# EAGLE design PIC32_Pinguino_Rev_B (EAGLE 4.16)
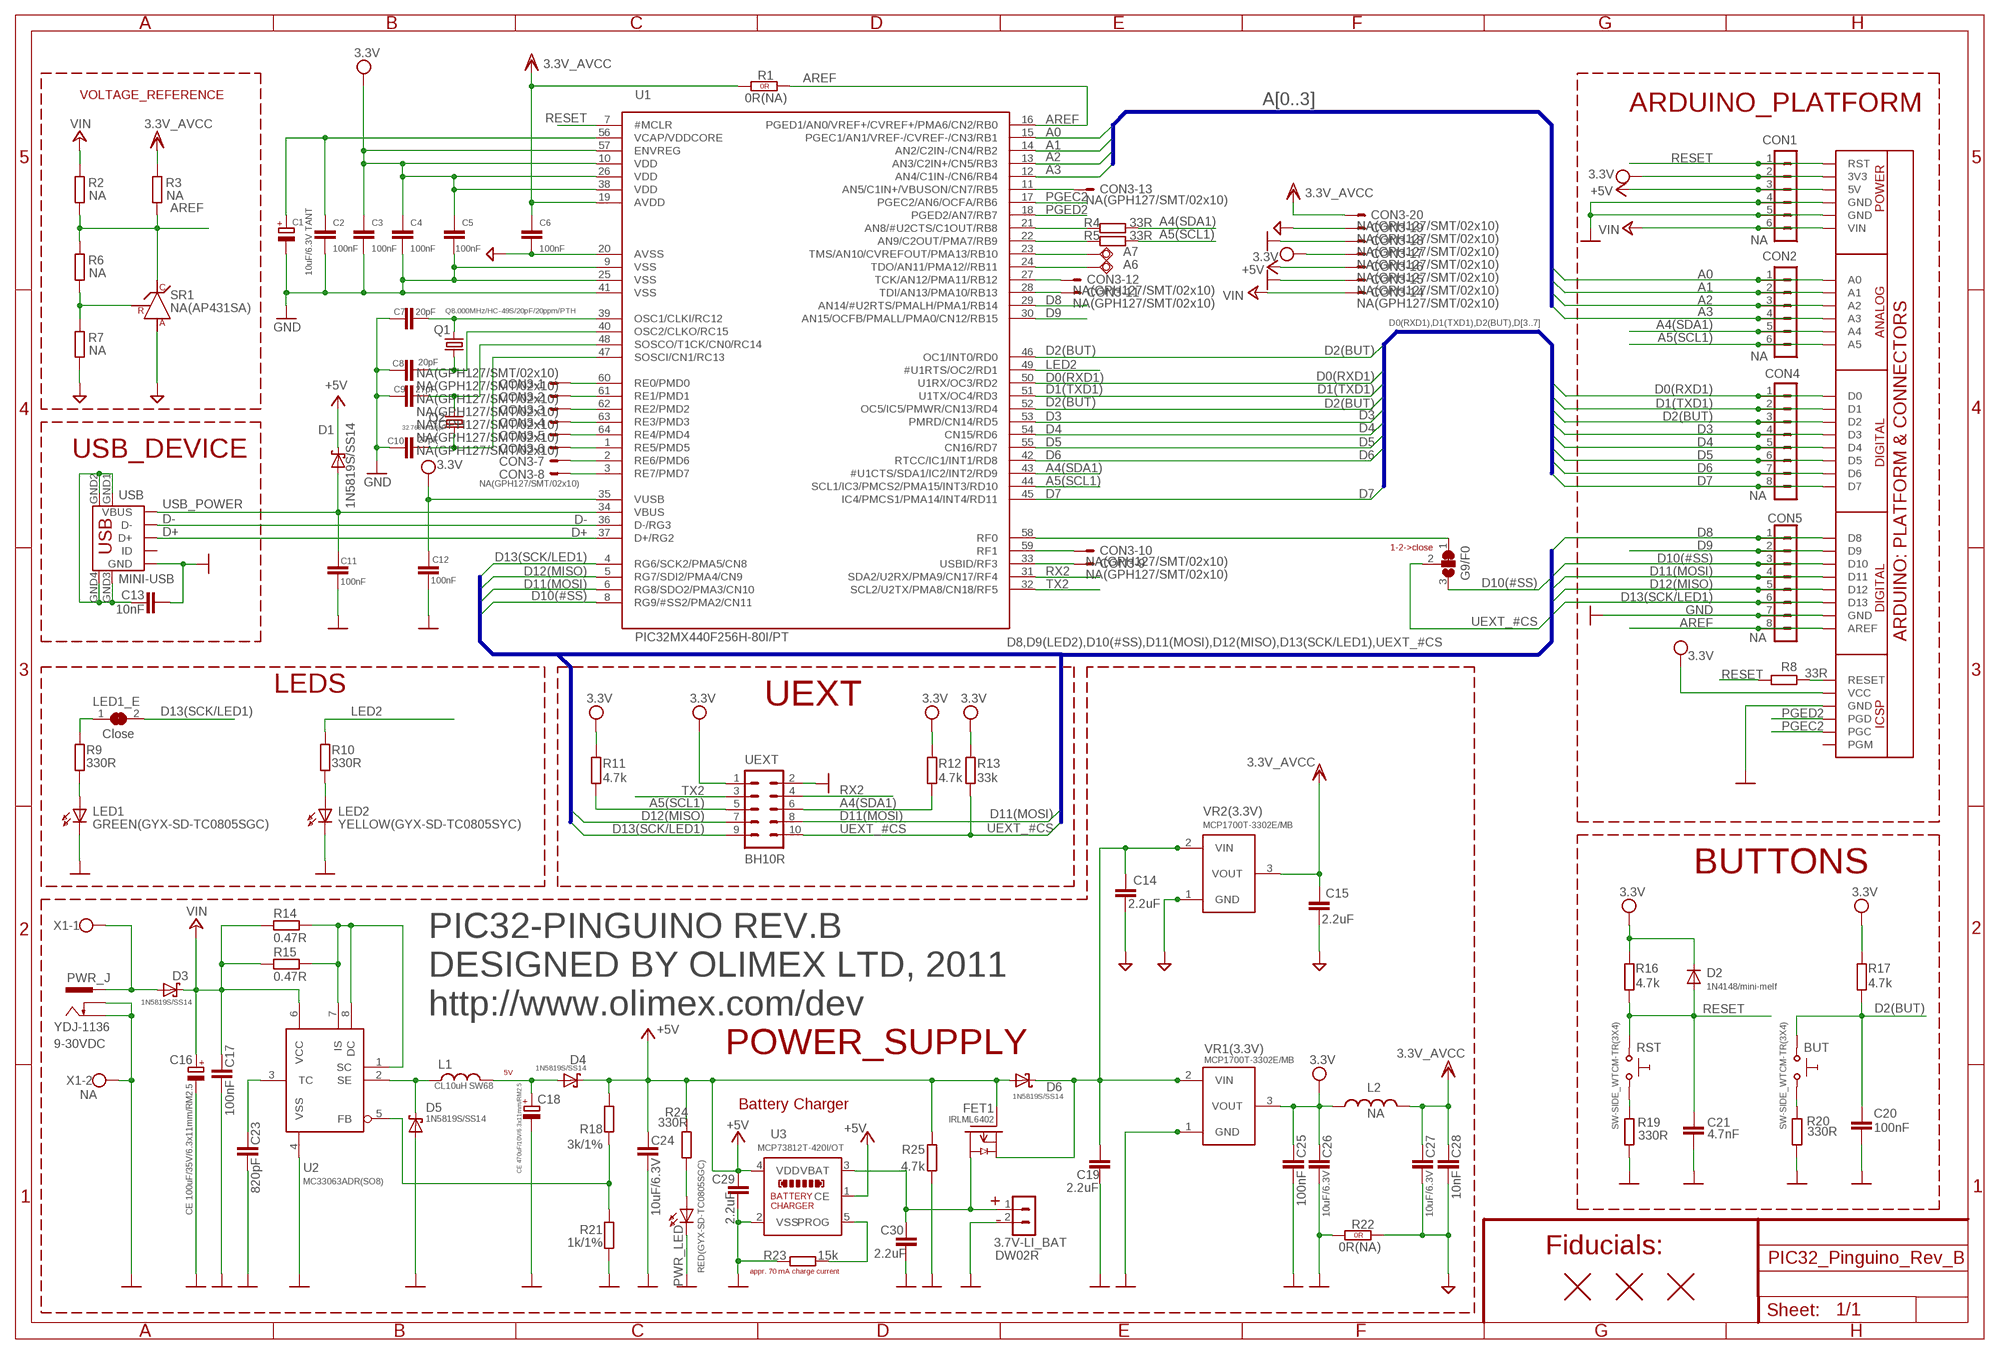
[diagram p0: schematic, sheet 1]

## Parts
3.7V-LI_BAT  DW02R  CON2DW02R  [DW02R]
A6  TESTPAD40/70  [TESTPAD]
A7  TESTPAD40/70  [TESTPAD]
BUT  SW-SIDE_WTCM-TR(3X4)  SW-TAKTSIDE_WTCM-TR(3X4)  [SW_TAKT3X4]
C1  10uF/6.3V TANT  CPOL-EUCT3216  [CT3216]
C2  100nF  C-EUC0603_DWS  [C0603_DWS]
C3  100nF  C-EUC0603_DWS  [C0603_DWS]
C4  100nF  C-EUC0603_DWS  [C0603_DWS]
C5  100nF  C-EUC0603_DWS  [C0603_DWS]
C6  100nF  C-EUC0603_DWS  [C0603_DWS]
C7  20pF  C-EUC0603_DWS  [C0603_DWS]
C8  20pF  C-EUC0603_DWS  [C0603_DWS]
C9  27pF  C-EUC0603_DWS  [C0603_DWS]
C10  27pF  C-EUC0603_DWS  [C0603_DWS]
C11  100nF  C-EUC0603_DWS  [C0603_DWS]
C12  100nF  C-EUC0603_DWS  [C0603_DWS]
C13  10nF  C-EUC0603_DWS  [C0603_DWS]
C14  2.2uF  C-EUC0603_DWS  [C0603_DWS]
C15  2.2uF  C-EUC0603_DWS  [C0603_DWS]
C16  CE 100uF/35V/6.3x11mm/RM2.5  CPOL-EUE2.5-6.3  [E2,5-6,3]
C17  100nF  C-EUC0603_DWS  [C0603_DWS]
C18  CE 470uF/10V/6.3x11mm/RM2.5  CPOL-EUE2.5-6.3  [E2,5-6,3]
C19  2.2uF  C-EUC0603_DWS  [C0603_DWS]
C20  100nF  C-EUC0603_DWS  [C0603_DWS]
C21  4.7nF  C-EUC0603_DWS  [C0603_DWS]
C23  820pF  C-EUC0603_DWS  [C0603_DWS]
C24  10uF/6.3V  C-EUC0805_5MIL_DWS  [C0805_5MIL_DWS]
C25  100nF  C-EUC0603_DWS  [C0603_DWS]
C26  10uF/6.3V  C-EUC0805_5MIL_DWS  [C0805_5MIL_DWS]
C27  10uF/6.3V  C-EUC0805_5MIL_DWS  [C0805_5MIL_DWS]
C28  10nF  C-EUC0603_DWS  [C0603_DWS]
C29  2.2uF  C-EUC0603_DWS  [C0603_DWS]
C30  2.2uF  C-EUC0603_DWS  [C0603_DWS]
CON1  NA  CON6PN1X6  [PN1X6]
CON2  NA  CON6PN1X6  [PN1X6]
CON3  NA(GPH127/SMT/02x10)  ML2050MILSE  [ML20_50MILS_M]
CON4  NA  CON8PN1X8  [PN1X8]
CON5  NA  CON8PN1X8  [PN1X8]
D1  1N5819S/SS14  SCHOTKKY7.62SS2  [MLL-41]
D2  1N4148/mini-melf  DSMD  [MINI-MELF]
D3  1N5819S/SS14  SCHOTKKY7.62SS2  [MLL-41]
D4  1N5819S/SS14  SCHOTKKY7.62SS2  [MLL-41]
D5  1N5819S/SS14  SCHOTKKY7.62SS2  [MLL-41]
D6  1N5819S/SS14  SCHOTKKY7.62SS2  [MLL-41]
FET1  IRLML6402  [SOT23]
G9/F0  SJ2W3  [SJ_2_SMALL]
L1  CL10uH SW68  LSW68  [SW68]
L2  NA  L-USL3216C  [L3216C]
LED1  GREEN(GYX-SD-TC0805SGC)  LED0805DWS  [LED-0805]
LED1_E  Close  SJSJ-CLOSE  [SJ-CLOSE]
LED2  YELLOW(GYX-SD-TC0805SYC)  LED0805DWS  [LED-0805]
PWR_J  YDJ-1136  PWR-JAKPWR_JACK_UNI_MILLING  [PWR_JACK_UNI_MILLING]
PWR_LED  RED(GYX-SD-TC0805SGC)  LED0805DWS  [LED-0805]
Q1  Q8.000MHz/HC-49S/20pF/20ppm/PTH  HC49/S1  [HC49/SMD2_THIN]
Q2  32.768 kHz/6pF  TC26HTC26H_3_REPAIR  [TC26H_3_REPAIR]
R1  0R(NA)  R_0R0R(NA)  [0603_0R]
R2  NA  R-EU_R0603_5MIL_DWS  [R0603_5MIL_DWS]
R3  NA  R-EU_R0603_5MIL_DWS  [R0603_5MIL_DWS]
R4  33R  R-EU_R0603_5MIL_DWS  [R0603_5MIL_DWS]
R5  33R  R-EU_R0603_5MIL_DWS  [R0603_5MIL_DWS]
R6  NA  R-EU_R0603_5MIL_DWS  [R0603_5MIL_DWS]
R7  NA  R-EU_R0603_5MIL_DWS  [R0603_5MIL_DWS]
R8  33R  R-EU_R0603_5MIL_DWS  [R0603_5MIL_DWS]
R9  330R  R-EU_R0603_5MIL_DWS  [R0603_5MIL_DWS]
R10  330R  R-EU_R0603_5MIL_DWS  [R0603_5MIL_DWS]
R11  4.7k  R-EU_R0603_5MIL_DWS  [R0603_5MIL_DWS]
R12  4.7k  R-EU_R0603_5MIL_DWS  [R0603_5MIL_DWS]
R13  33k  R-EU_R0603_5MIL_DWS  [R0603_5MIL_DWS]
R14  0.47R  R-EU_R1206_5MIL_WS  [R1206_5MIL_WS]
R15  0.47R  R-EU_R1206_5MIL_WS  [R1206_5MIL_WS]
R16  4.7k  R-EU_R0603_5MIL_DWS  [R0603_5MIL_DWS]
R17  4.7k  R-EU_R0603_5MIL_DWS  [R0603_5MIL_DWS]
R18  3k/1%  R-EU_R0603_5MIL_DWS  [R0603_5MIL_DWS]
R19  330R  R-EU_R0603_5MIL_DWS  [R0603_5MIL_DWS]
R20  330R  R-EU_R0603_5MIL_DWS  [R0603_5MIL_DWS]
R21  1k/1%  R-EU_R0603_5MIL_DWS  [R0603_5MIL_DWS]
R22  0R(NA)  R_0R0R(NA)  [0603_0R]
R23  15k  R-EU_R0603_5MIL_DWS  [R0603_5MIL_DWS]
R24  330R  R-EU_R0603_5MIL_DWS  [R0603_5MIL_DWS]
R25  4.7k  R-EU_R0603_5MIL_DWS  [R0603_5MIL_DWS]
RST  SW-SIDE_WTCM-TR(3X4)  SW-TAKTSIDE_WTCM-TR(3X4)  [SW_TAKT3X4]
SR1  NA(AP431SA)  TL431'''  [SOT-23]
U1  PIC32MX440F256H-80I/PT  PIC32MX440F256H"  [LPTQFP64]
U2  MC33063ADR(SO8)  MC34063A2  [SO-8]
U3  MCP73812T-420I/OT  MCP7381XSOT-23-5  [SOT-23-5]
U$1  3xPN1x8+1xPN1x6+WU06S  PIC_PLATFORM  [PIC_PLATFORM]
U$2  FIDUCIAL1X2  [FIDUCIAL-1X2]
U$3  FIDUCIAL1X2  [FIDUCIAL-1X2]
U$4  FIDUCIAL1X2  [FIDUCIAL-1X2]
UEXT  BH10R  ML10L  [ML10L]
USB  MINI-USB  MINI_USB9  [USB_MINI_9PIN]
VR1(3.3V)  MCP1700T-3302E/MB  MCP1700-REP1  [SOT89_REP_THERMALOFF]
VR2(3.3V)  MCP1700T-3302E/MB  MCP1700-REP1  [SOT89_REP_THERMALOFF]
X1  NA  W237-102  [W237-102]

## Nets
+5V: C24.1 C29.1 CON1.3 CON3.16 D1.K(C) D4.K(C) D6.A FET1.1(G) R18.1 R24.1 R25.1 U3.1(CE) U3.4(VDD) U$1.5V
+24V: C16.+ C17.1 CON1.6 CON3.14 D3.K(C) R2.2 R14.1 R15.1 U2.6(VCC) U$1.VIN ; supply symbol labelled VIN
A0: CON2.1 U1.15(PGEC1/AN1/VREF-/CVREF-/CN3/RB1) U$1.A0
A1: CON2.2 U1.14(AN2/C2IN-/CN4/RB2) U$1.A1
A2: CON2.3 U1.13(AN3/C2IN+/CN5/RB3) U$1.A2
A3: CON2.4 U1.12(AN4/C1IN-/CN6/RB4) U$1.A3
A4(SDA1): CON2.5 R4.1 R12.1 U1.43(#U1CTS/SDA1/IC2/INT2/RD9) U$1.A4 UEXT.6
A5(SCL1): CON2.6 R5.1 R11.1 U1.44(SCL1/IC3/PMCS2/PMA15/INT3/RD10) U$1.A5 UEXT.5
AGND: C6.2 C14.2 C15.2 C27.2 C28.2 CON3.19 R7.1 R22.2(1.2) SR1.3(A) U1.20(AVSS) VR2(3.3V).1(GND)
AREF: CON5.8 R1.2(1.2) R2.1 R3.1 R6.2 SR1.1(C) U1.16(PGED1/AN0/VREF+/CVREF+/PMA6/CN2/RB0) U$1.AREF
D0(RXD1): CON4.1 U1.50(U1RX/OC3/RD2) U$1.D0
D1(TXD1): CON4.2 U1.51(U1TX/OC4/RD3) U$1.D1
D2(BUT): BUT.2_1 C20.1 CON4.3 R17.2 U1.46(OC1/INT0/RD0) U1.52(OC5/IC5/PMWR/CN13/RD4) U$1.D2
D3: CON4.4 U1.53(PMRD/CN14/RD5) U$1.D3
D4: CON4.5 U1.54(CN15/RD6) U$1.D4
D5: CON4.6 U1.55(CN16/RD7) U$1.D5
D6: CON4.7 U1.42(RTCC/IC1/INT1/RD8) U$1.D6
D7: CON4.8 U1.45(IC4/PMCS1/PMA14/INT4/RD11) U$1.D7
D8: CON5.1 U1.29(AN14/#U2RTS/PMALH/PMA1/RB14) U$1.D8
D9: CON5.2 U1.30(AN15/OCFB/PMALL/PMA0/CN12/RB15) U$1.D9
D10(#SS): CON5.3 G9/F0.3 U1.8(RG9/#SS2/PMA2/CN11) U$1.D10
D11(MOSI): CON5.4 U1.6(RG8/SDO2/PMA3/CN10) U$1.D11 UEXT.8
D12(MISO): CON5.5 U1.5(RG7/SDI2/PMA4/CN9) U$1.D12 UEXT.7
D13(SCK/LED1): CON5.6 LED1_E.2 U1.4(RG6/SCK2/PMA5/CN8) U$1.D13 UEXT.9
D+: U1.37(D+/RG2) USB.D+
D-: U1.36(D-/RG3) USB.D-
GND [pwr]: 3.7V-LI_BAT.2 C1.- C2.2 C3.2 C4.2 C5.2 C7.1 C8.1 C9.1 C10.1 C11.1 C12.1 C13.2 C16.- C17.2 C18.- C19.2 C20.2 C21.2 C23.2 C24.2 C25.2 C26.2 C29.2 C30.2 CON1.4 CON1.5 CON3.15 CON3.18 CON5.7 D5.A LED1.C LED2.C PWR_J.- PWR_J.-- PWR_LED.C R19.1 R20.1 R21.2 R22.1(1.1) R23.1 R25.2 U1.9(VSS) U1.25(VSS) U1.41(VSS) U2.4(VSS) U3.2(VSS) U$1.GND U$1.GND@1(GND) U$1.GND@2(GND) U$1.GND@3(GND) UEXT.2 USB.GND VR1(3.3V).1(GND) X1.2
LED2: R10.2 U1.49(#U1RTS/OC2/RD1)
N$1: CON3.13 U1.11(AN5/C1IN+/VBUSON/CN7/RB5)
N$2: LED1_E.1 R9.2
N$3: R4.2 U1.21(AN8/#U2CTS/C1OUT/RB8)
N$4: R8.1 U$1.RESET
N$5: LED2.A R10.1
N$6: R5.2 U1.22(AN9/C2OUT/PMA7/RB9)
N$7: C18.+ D4.A L1.2
N$8: PWR_LED.A R24.2
N$9: A6.P$1(PP) U1.24(TDO/AN11/PMA12//RB11)
N$10: A7.P$1(PP) U1.23(TMS/AN10/CVREFOUT/PMA13/RB10)
N$11 [pwr]: R19.2 RST.1_1
N$12 [pwr]: BUT.1_1 R20.2
N$13: D3.A PWR_J.+ X1.1
N$14: CON3.12 U1.27(TCK/AN12/PMA11/RB12)
N$15: CON3.11 U1.28(TDI/AN13/PMA10/RB13)
N$16: C1.+ C2.1 U1.56(VCAP/VDDCORE)
N$17: C7.2 Q1.2 U1.39(OSC1/CLKI/RC12)
N$18: CON3.10 U1.59(RF1)
N$19: C8.2 Q1.1 U1.40(OSC2/CLKO/RC15)
N$20: C10.2 Q2.2 U1.47(SOSCI/CN1/RC13)
N$21: C9.2 Q2.1 U1.48(SOSCO/T1CK/CN0/RC14)
N$22: R23.2 U3.5(PROG)
N$23: LED1.A R9.1
N$24: CON3.9 U1.33(USBID/RF3)
N$25: CON3.1 U1.60(RE0/PMD0)
N$26: CON3.2 U1.61(RE1/PMD1)
N$27: CON3.3 U1.62(RE2/PMD2)
N$28: CON3.4 U1.63(RE3/PMD3)
N$29: CON3.5 U1.64(RE4/PMD4)
N$30: CON3.6 U1.1(RE5/PMD5)
N$31: CON3.7 U1.2(RE6/PMD6)
N$32: CON3.8 U1.3(RE7/PMD7)
N$33: C23.1 U2.3(TC)
N$34: C14.1 C19.1 D6.K(C) FET1.2(S) VR1(3.3V).2(VIN) VR1(3.3V).P$2(VIN1) VR2(3.3V).2(VIN) VR2(3.3V).P$2(VIN1)
N$36: R6.1 R7.2 SR1.2(R)
N$38: G9/F0.1 U1.58(RF0)
N$61: R18.2 R21.1 U2.5(FB)
N$64: R14.2 R15.2 U2.1(SC) U2.7(IS) U2.8(DC)
N$67 [pwr]: D5.K(C) L1.1 U2.2(SE)
PGEC2: U1.17(PGEC2/AN6/OCFA/RB6) U$1.PGC
PGED2: U1.18(PGED2/AN7/RB7) U$1.PGD
RESET: C21.1 CON1.1 D2.A R8.2 R16.2 RST.2_1 U1.7(#MCLR) U$1.RST
RX2: U1.31(SDA2/U2RX/PMA9/CN17/RF4) UEXT.4
TX2: U1.32(SCL2/U2TX/PMA8/CN18/RF5) UEXT.3
UEXT_#CS: G9/F0.2 R13.1 UEXT.10
USB_POWER: C11.2 D1.A U1.34(VBUS) USB.VBUS
USB_SHIELD: C13.1 USB.GND1 USB.GND2 USB.GND3 USB.GND4
VBAT: 3.7V-LI_BAT.1 C30.1 FET1.3(D) U3.3(VBAT)
VCC: C3.1 C4.1 C5.1 C12.2 C25.1 C26.1 CON1.2 CON3.17 D2.C(K) L2.1 R11.2 R12.2 R13.2 R16.1 R17.1 U1.10(VDD) U1.26(VDD) U1.35(VUSB) U1.38(VDD) U1.57(ENVREG) U$1.3V3 U$1.VCC UEXT.1 VR1(3.3V).3(VOUT) ; supply symbol labelled 3.3V
VDD: C6.1 C15.1 C27.1 C28.1 CON3.20 L2.2 R1.1(1.1) R3.2 U1.19(AVDD) VR2(3.3V).3(VOUT) ; supply symbol labelled 3.3V_AVCC
Unconnected: U$1.PGM USB.ID

## Buses
A[0..3]
D0(RXD1),D1(TXD1),D2(BUT),D[3..7]
D8,D9(LED2),D10(#SS),D11(MOSI),D12(MISO),D13(SCK/LED1),UEXT_#CS

## Notes on the sheet
- VOLTAGE_REFERENCE
- ARDUINO_PLATFORM
- USB_DEVICE
- 1-2->close
- LEDS
- UEXT
- BUTTONS
- PIC32-PINGUINO REV.B
- DESIGNED BY OLIMEX LTD, 2011
- http://www.olimex.com/dev
- 9-30VDC
- POWER_SUPPLY
- 5V
- Battery Charger
- +
- -
- Fiducials:
- appr. 70 mA charge current

## Library data of the parts
3.7V-LI_BAT = Penko:CON2
A6 A7 = gogo:TESTPAD: drill 40mils, diameter 70mils
BUT RST = gogo:SW-TAKT
C1 C16 C18 = rcl:CPOL-EU: POLARIZED CAPACITOR, European symbol
C2-C15 C17 C19-C21 C23-C30 = rcl:C-EU: CAPACITOR, European symbol
CON1 CON2 = Penko:CON6: CONNECTORS - 6 PINS
CON3 = con-harting-ml:ML20?E: HARTING
CON4 CON5 = Penko:CON8
D1 D3-D6 = gogo:SCHOTKKY7.62SS
D2 = DOUBLE-SIDE:D: DIODES
FET1 = gogo:IRLML6402
G9/F0 = jumper:SJ2W: SMD solder JUMPER
L1 = DOUBLE-SIDE:L
L2 = rcl:L-US: INDUCTOR, American symbol
LED1 LED2 PWR_LED = DOUBLE-SIDE:LED
LED1_E = jumper:SJ: SMD solder JUMPER
PWR_J = gogo:PWR-JAK
Q1 = crystal:HC49/S: CRYSTAL
Q2 = crystal:TC26H: CRYSTAL
R1 R22 = OLIMEX_DISCRET:R_0R
R2-R21 R23-R25 = rcl:R-EU_: RESISTOR, European symbol
SR1 = OLIMEX_IC:TL431: TL431 Programmable Shunt Regulator Features: -> Programmable Output Voltage to 36 Volts -> Low Dynamic Output Impedance 0.20 Typical -> Sink Current Capability of 1.0 to 100mA -> Equivalent Full-Range Temperature Coefficient of 50ppm/°C Typical -> Temperature Compensated For Operation Over Full Rated Operating Temperature Range -> Low Output Noise Voltage -> Fast Turn-on Response
U1 = OLIMEX_IC:PIC32MX440F256H: USB Microcontroller MIPS32® M4K® 32-bit core with 5-stage pipeline 80 MHz maximum frequency 1.56 DMIPS/MHz (Dhrystone 2.1) performance at wait state Flash access Single-cycle multiply and high-performance divide unit MIPS16e® mode for up to 40% smaller code size Two sets of 32 core register files (32-bit) to reduce interrupt latency Prefetch Cache module to speed execution from Flash
U2 = MPLAB_ICD2:MC34063A
U3 = OLIMEX_DISCRET:MCP7381X
U$1 = OLIMEX_CASES:PIC_PLATFORM
U$2-U$4 = SparkFunEagle-6-6-07:FIDUCIAL: Fiducial Alignment Points Various fiducial points for machine vision alignment.
UEXT = con-harting-ml:ML10: HARTING
USB = OLIMEX_CONNECTORS:MINI_USB9
VR1(3.3V) VR2(3.3V) = OLIMEX_DISCRET:MCP1700-REP
X1 = con-wago-500:W237-102: WAGO SCREW CLAMP

## Net classes
1 pwr: width 0.4 mm, drill 0.23 mm

## Board
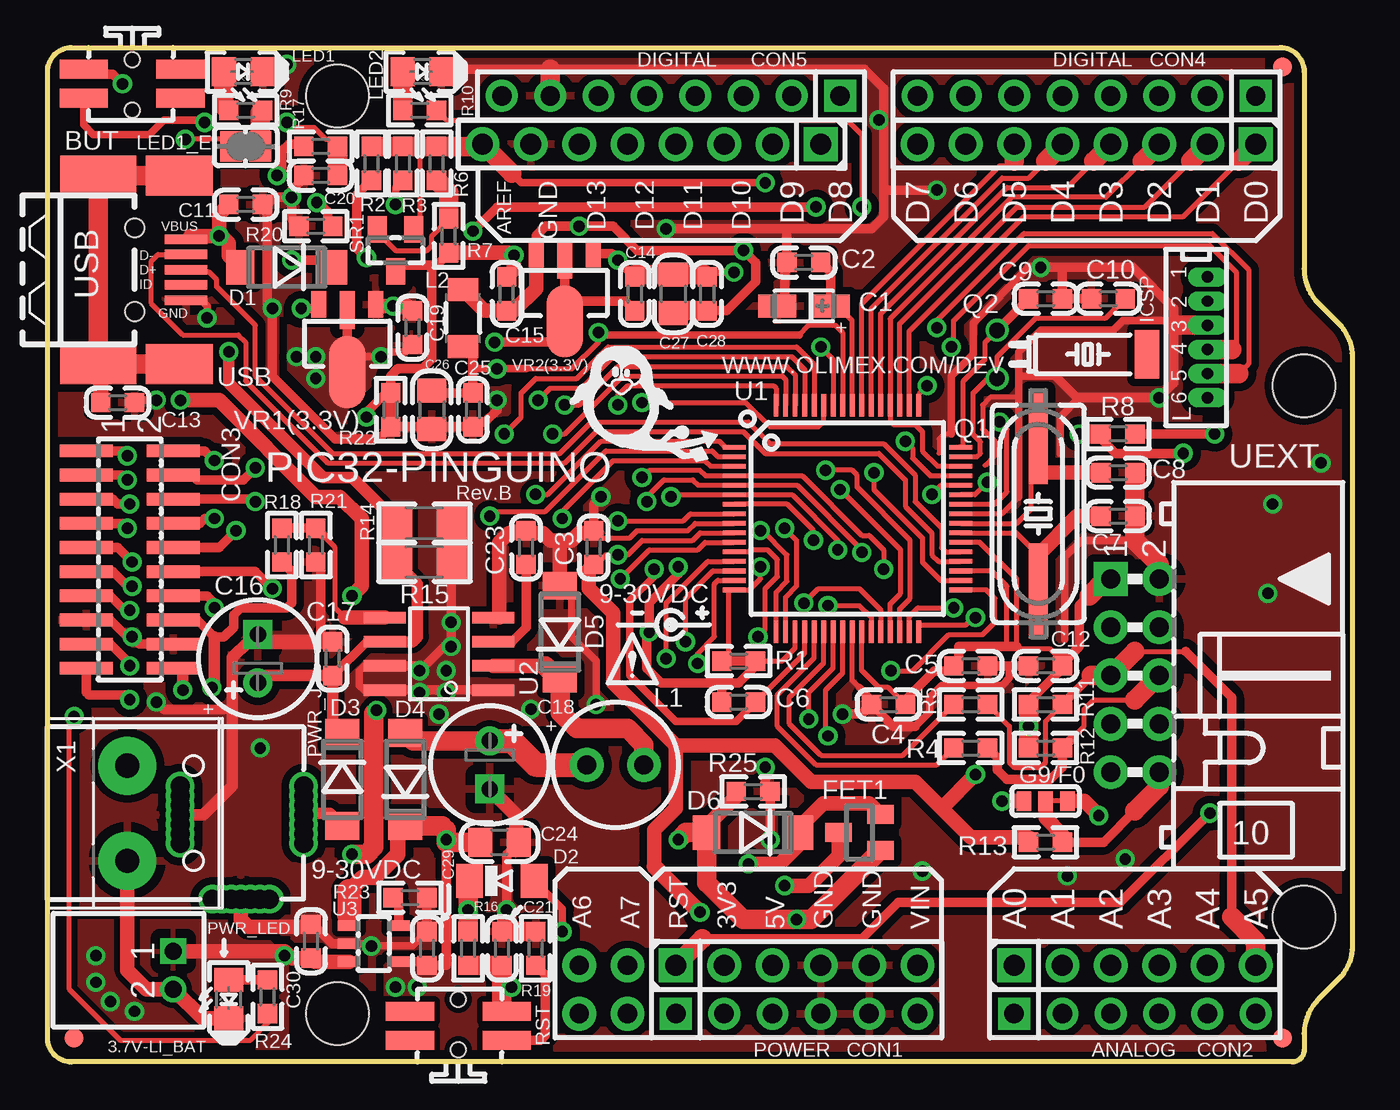
[diagram p1: board, top side]
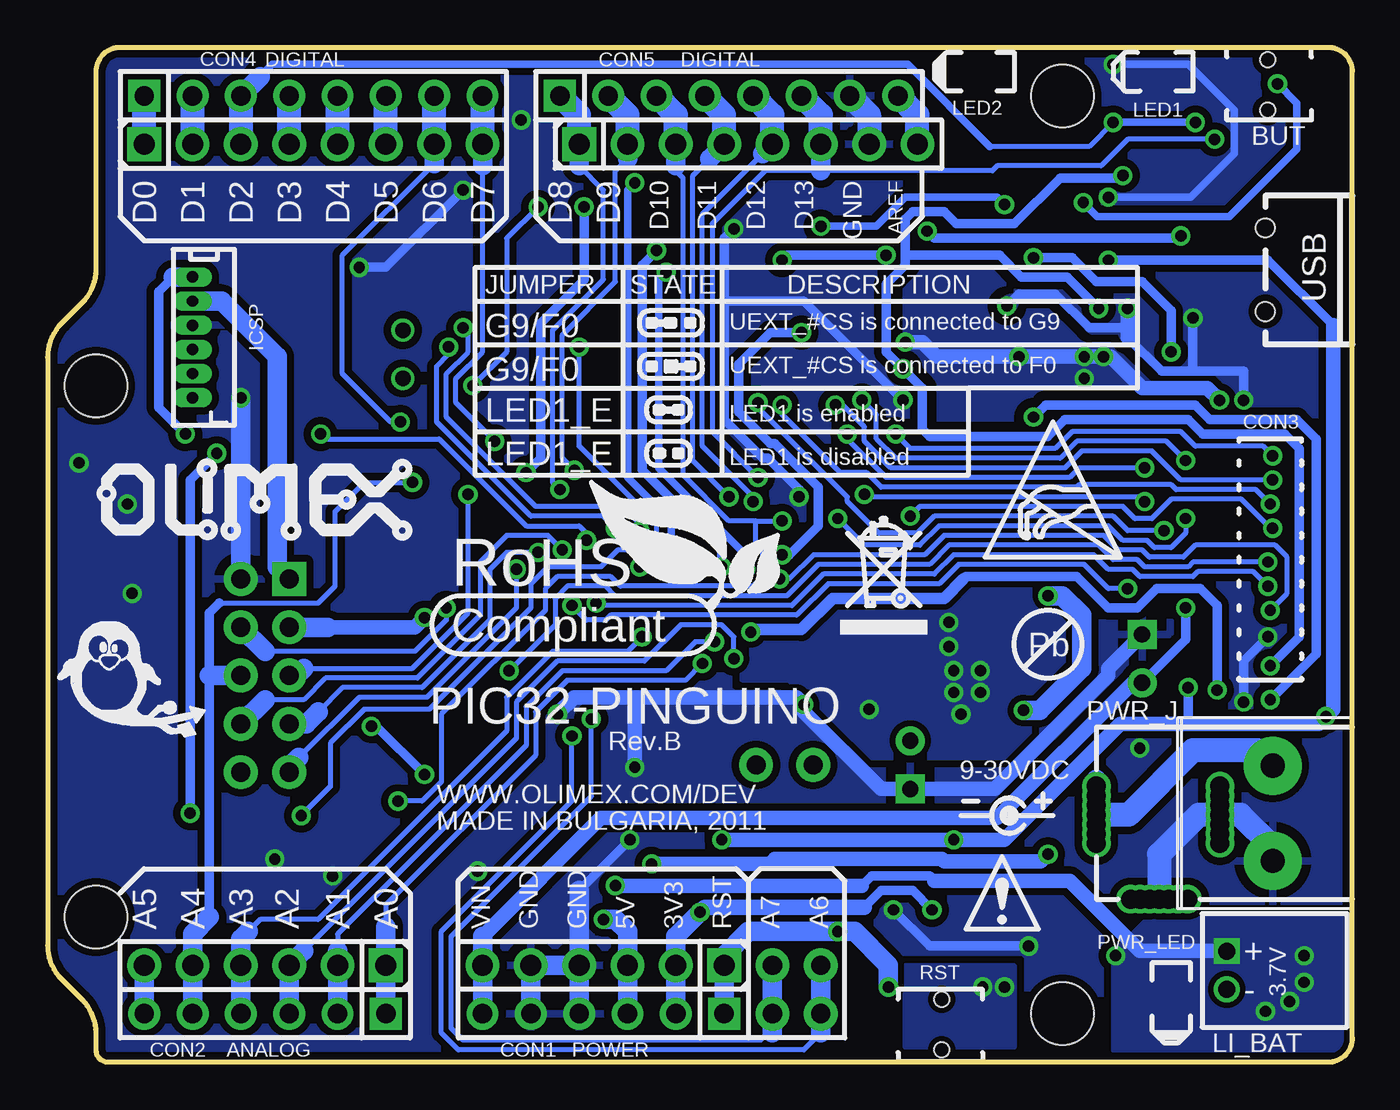
[diagram p2: board, bottom side, seen from below]

Size 68.58 x 53.34 mm. Coordinates in mm from the lower left corner, seen from the top.
Copper layers (1+16): Top 0.035mm / dielectric 1.5mm / Bottom 0.035mm
Design rules "default": minimum track width 10mil, minimum drill 0.6mm, track to track 9.5mil, track to pad 9.5mil, pad to pad 9.5mil, via to via 9.5mil, smd to smd 1mil, copper to edge 10mil, drill to drill 8mil, minimum pad ring 8mil, minimum via ring 8mil, stop-mask expansion 4mil, vias tented up to drill 25mil, thermal gap 20mil

### Footprints (pad centres in the part's own frame; a part is rotated, then mirrored left to right if it is on the bottom)
DW02R = drill 0.9 square: 1 -1,0 | drill 0.9 round: 2 1,0
TESTPAD = drill 1.016 pad 1.778 round: P$1 0,0
SW_TAKT3X4 = smd 2.54 x 1.016: 1_1 -2.54,0.762; 1_2 2.54,0.762; 2_1 -2.54,-0.762; 2_2 2.54,-0.762 | hole 0.8: 0,-1.397; 0,1.27
CT3216 = smd 2 x 1.2: + -1.4,0; - 1.4,0
C0603_DWS = smd 1.016 x 1.016: 1 -0.889,0; 2 0.889,0
E2,5-6,3 = drill 0.864 pad 1.524 round: + -1.27,0 | drill 0.864 pad 1.524 square: - 1.27,0
C0805_5MIL_DWS = smd 1.27 x 1.524: 1 -1.016,0; 2 1.016,0
PN1X6 = drill 1.1 pad 1.778 square: 1 -6.35,0 | drill 1.1 pad 1.778 round: 2 -3.81,0; 3 -1.27,0; 4 1.27,0; 5 3.81,0; 6 6.35,0
ML20_50MILS_M = smd 0.66 x 2.794: 1 -5.715,-2.286; 2 -5.715,2.286; 3 -4.445,-2.286; 4 -4.445,2.286; 5 -3.175,-2.286; 6 -3.175,2.286; 7 -1.905,-2.286; 8 -1.905,2.286; 9 -0.635,-2.286; 10 -0.635,2.286; 11 0.635,-2.286; 12 0.635,2.286; 13 1.905,-2.286; 14 1.905,2.286; 15 3.175,-2.286; 16 3.175,2.286; 17 4.445,-2.286; 18 4.445,2.286; 19 5.715,-2.286; 20 5.715,2.286
PN1X8 = drill 1.1 pad 1.778 square: 1 -8.89,0 | drill 1.1 pad 1.778 round: 2 -6.35,0; 3 -3.81,0; 4 -1.27,0; 5 1.27,0; 6 3.81,0; 7 6.35,0; 8 8.89,0
MLL-41 = smd 1.45 x 1.8: A 2.445,0; K -2.445,0
MINI-MELF = smd 1.4 x 1.8: A 1.7,0; C -1.7,0
SOT23 = smd 1 x 1.4: 1 -0.95,-1.1; 2 0.95,-1.1; 3 0,1.1
SJ_2_SMALL = smd 0.762 x 1.016: 1 -1.143,0; 2 0,0; 3 1.143,0
SW68 = drill 1 pad 1.778 round: 1 -1.5,0; 2 1.5,0
L3216C = smd 1.2 x 1.6: 1 -1.5,0; 2 1.5,0
LED-0805 = smd 1.27 x 1.524: A 1.016,0; C -1.016,0
SJ-CLOSE = smd 1.168 x 1.6: 1 -0.762,0; 2 0.762,0
PWR_JACK_UNI_MILLING = drill 1 round: + 0,4.75; +1 0,5.25; +2 0,5.75; +3 0,6.25; +4 0,4.25; +5 0,3.75; +6 0,3.25; - -6.5,4.75; -1 -6.5,5.25; -2 -6.5,5.75; -3 -6.5,4.25; -4 -6.5,3.75; -5 -6.5,6.25; -6 -6.5,3.25; -- -3.3,0.3; --1 -3.8,0.3; --2 -4.3,0.3; --3 -4.8,0.3; --4 -2.8,0.3; --5 -2.3,0.3; --6 -1.8,0.3
HC49/SMD2_THIN = smd 5 x 1: 1 -4.064,0; 2 4.064,0
TC26H_3_REPAIR = drill 0.813 round: 1 -1.27,0; 2 1.27,0 | smd 2.54 x 1.27: GND 0,7.874
0603_0R = smd 1.016 x 1.016: 1 -0.889,0; 2 0.889,0
R0603_5MIL_DWS = smd 1.016 x 1.016: 1 -0.889,0; 2 0.889,0
R1206_5MIL_WS = smd 1.651 x 1.778: 1 -1.46,0; 2 1.46,0
SOT-23 = smd 1 x 1.4: 1 -0.95,-1.1; 2 0.95,-1.1; 3 0,1.1
LPTQFP64 = smd 1.2 x 0.254: 1 -5.95,3.75; 2 -5.95,3.25; 3 -5.95,2.75; 4 -5.95,2.25; 5 -5.95,1.75; 6 -5.95,1.25; 7 -5.95,0.75; 8 -5.95,0.25; 9 -5.95,-0.25; 10 -5.95,-0.75; 11 -5.95,-1.25; 12 -5.95,-1.75; 13 -5.95,-2.25; 14 -5.95,-2.75; 15 -5.95,-3.25; 16 -5.95,-3.75; 33 5.95,-3.75; 34 5.95,-3.25; 35 5.95,-2.75; 36 5.95,-2.25; 37 5.95,-1.75; 38 5.95,-1.25; 39 5.95,-0.75; 40 5.95,-0.25; 41 5.95,0.25; 42 5.95,0.75; 43 5.95,1.25; 44 5.95,1.75; 45 5.95,2.25; 46 5.95,2.75; 47 5.95,3.25; 48 5.95,3.75 | smd 0.254 x 1.2: 17 -3.75,-5.95; 18 -3.25,-5.95; 19 -2.75,-5.95; 20 -2.25,-5.95; 21 -1.75,-5.95; 22 -1.25,-5.95; 23 -0.75,-5.95; 24 -0.25,-5.95; 25 0.25,-5.95; 26 0.75,-5.95; 27 1.25,-5.95; 28 1.75,-5.95; 29 2.25,-5.95; 30 2.75,-5.95; 31 3.25,-5.95; 32 3.75,-5.95; 49 3.75,5.95; 50 3.25,5.95; 51 2.75,5.95; 52 2.25,5.95; 53 1.75,5.95; 54 1.25,5.95; 55 0.75,5.95; 56 0.25,5.95; 57 -0.25,5.95; 58 -0.75,5.95; 59 -1.25,5.95; 60 -1.75,5.95; 61 -2.25,5.95; 62 -2.75,5.95; 63 -3.25,5.95; 64 -3.75,5.95
SO-8 = smd 0.6 x 2.2: 1 -1.905,-2.854; 2 -0.635,-2.854; 3 0.635,-2.854; 4 1.905,-2.854; 5 1.905,2.854; 6 0.635,2.854; 7 -0.635,2.854; 8 -1.905,2.854
SOT-23-5 = smd 0.55 x 1.2: 1 -0.95,-1.3; 2 0,-1.3; 3 0.95,-1.3; 4 0.95,1.3; 5 -0.95,1.3
PIC_PLATFORM = drill 1.016 pad 1.676 round: 3V3 1.27,-24.13; 5V 3.81,-24.13; A1 19.05,-24.13; A2 21.59,-24.13; A3 24.13,-24.13; A4 26.67,-24.13; A5 29.21,-24.13; AREF -10.414,24.13; D1 26.67,24.13; D2 24.13,24.13; D3 21.59,24.13; D4 19.05,24.13; D5 16.51,24.13; D6 13.97,24.13; D7 11.43,24.13; D9 4.826,24.13; D10 2.286,24.13; D11 -0.254,24.13; D12 -2.794,24.13; D13 -5.334,24.13; GND 6.35,-24.13; GND@1 8.89,-24.13; GND@2 -7.874,24.13; VIN 11.43,-24.13 | drill 1.016 pad 1.676 square: A0 16.51,-24.13; D0 29.21,24.13; D8 7.366,24.13; RST -1.27,-24.13 | drill 0.6 pad 1.016 long: GND@3 26.67,12.065; PGC 26.67,9.525; PGD 26.67,10.795; PGM 26.67,8.255; RESET 26.67,14.605; VCC 26.67,13.335 | hole 3.3: 31.75,8.89; 31.75,-19.05; -19.05,24.13; -19.05,-24.13
FIDUCIAL-1X2 = smd 1 x 1: 1 0,0
ML10L = drill 1 pad 1.778 square: 1 -5.08,-1.27 | drill 1 pad 1.778 round: 2 -5.08,1.27; 3 -2.54,-1.27; 4 -2.54,1.27; 5 0,-1.27; 6 0,1.27; 7 2.54,-1.27; 8 2.54,1.27; 9 5.08,-1.27; 10 5.08,1.27
USB_MINI_9PIN = smd 2.25 x 0.5: D+ 2.706,0; D- 2.706,0.8; GND 2.706,-1.6; ID 2.706,-0.8; VBUS 2.706,1.6 | smd 4 x 2.1: GND1 -1.9,4.95; GND3 -1.9,-4.95 | smd 3.5 x 2.1: GND2 2.35,4.95; GND4 2.35,-4.95 | hole 1: 0,2.2; 0,-2.2
SOT89_REP_THERMALOFF = smd 0.8 x 1.4: 1 -1.499,-1.981; 3 1.499,-1.981 | smd 0.8 x 2: 2 0,-1.681 | smd 1.93 x 3.81: P$2 0,1.57
W237-102 = drill 1.27 pad 3.048 round: 1 -2.5,-1.27; 2 2.5,-1.27

### Placement (x,y rotation side)
3.7V-LI_BAT  6.6,4.83 270 top
A6  27.94,2.54 90 top
A7  30.48,2.54 90 top
BUT  4.45,51.44 0 top
C1  39.75,39.75 180 top
C2  39.75,42.04 180 top
C3  28.7,27.05 90 top
C4  44.2,18.8 180 top
C5  48.51,20.83 0 top
C6  36.32,18.92 0 top
C7  56.26,28.7 180 top
C8  56.26,30.99 180 top
C9  52.45,40.13 180 top
C10  55.75,40.13 0 top
C11  10.41,45.09 180 top
C12  52.45,20.83 0 top
C13  3.68,34.67 0 top
C14  30.86,40.39 90 top
C15  24.13,40.39 90 top
C16  11.05,21.21 90 top
C17  14.99,21.21 90 top
C18  23.24,15.62 270 top
C19  19.18,38.61 90 top
C20  14.35,46.61 180 top
C21  23.88,5.97 90 top
C23  25.15,27.05 90 top
C24  23.75,11.56 0 top
C25  22.35,34.29 270 top
C26  20.19,34.29 270 top
C27  32.89,40.39 90 top
C28  34.67,40.39 90 top
C29  19.94,5.97 90 top
C30  13.84,6.35 90 top
CON1  39.37,5.08 0 top
CON2  57.15,5.08 0 top
CON3  4.32,26.42 270 top
CON4  54.61,48.26 180 top
CON5  31.75,48.26 180 top
D1  12.57,41.78 180 top
D2  23.88,9.53 0 top
D3  15.49,14.86 270 top
D4  18.8,14.86 90 top
D5  26.92,22.61 90 top
D6  37.08,12.06 180 top
FET1  42.67,12.06 90 top
G9/F0  52.45,13.72 180 top
L1  29.84,15.62 180 top
L2  21.84,39.12 90 top
LED1  10.29,52.07 180 top
LED1_E  10.41,48.13 180 top
LED2  19.68,52.07 180 top
PWR_J  13.46,8.26 0 top
PWR_LED  9.53,3.3 90 top
Q1  52.07,28.83 270 top
Q2  49.91,37.21 270 top
R1  36.32,21.08 180 top
R2  17.02,47.24 270 top
R3  18.67,47.24 270 top
R4  48.51,16.51 180 top
R5  48.51,18.8 180 top
R6  20.45,47.24 90 top
R7  21.08,43.43 90 top
R8  56.26,33.02 180 top
R9  10.41,50.04 0 top
R10  19.56,50.04 0 top
R11  52.45,18.8 180 top
R12  52.45,16.51 180 top
R13  52.45,11.56 180 top
R14  19.81,28.32 0 top
R15  19.81,26.29 0 top
R16  22.1,5.97 270 top
R17  14.35,48.13 0 top
R18  12.32,27.18 90 top
R19  25.65,5.97 270 top
R20  14.1,43.94 0 top
R21  14.1,27.18 270 top
R22  18.03,34.29 90 top
R23  19.05,8.64 180 top
R24  11.56,3.43 90 top
R25  37.08,14.22 0 top
RST  21.59,1.91 180 top
SR1  18.29,42.67 180 top
U1  42.04,28.57 0 top
U2  20.57,21.46 90 top
U3  17.14,6.22 270 top
U$1  34.29,26.67 0 top
U$2  1.4,1.27 90 top
U$3  64.9,1.27 90 top
U$4  64.9,52.32 90 top
U$5  [PB_SMALL]  16,21.97 0 bottom
U$6  [RECYCLE_BIN1/8]  26.92,22.48 0 bottom
U$7  [ESD_SYMBOL]  19.3,26.54 0 bottom
U$8  [ATTENTION_SMALL]  29.46,19.93 0 top
U$9  [PENGUIN_8X6MM_RIGHT]  30.23,34.29 0 top
U$10  [ROHS]  47.37,22.1 0 bottom
U$11  [PENGUIN_8X6MM_RIGHT]  65.28,19.81 0 bottom
U$12  [OLIMEX1_V]  48.26,27.3 0 bottom
U$13  [ATTENTION]  20.32,6.99 0 bottom
UEXT  57.15,20.32 270 top
USB  4.57,41.66 0 top
VR1(3.3V)  15.75,37.85 180 top
VR2(3.3V)  27.18,40.51 180 top
X1  5.46,13.08 270 top

### Tracks (layer width: path | path; a pad name or v marks a point on that pad's centre or on a via)
+5V  (via drill 0.6, 0.6 pad 0.41)
  Top 0.254: R24.1 11.56,2.03 10.67,1.14 3.81,1.14 1.14,3.81 1.14,17.91 v1.4,18.16
  Top 0.508: U3.4 19.75,5.27 C29.1 20.95,5.08 20.95,11.56 | D4.K 18.51,12.41 | CON3.16 7.87,23.24 8.76,22.35 9.27,22.35 9.78,22.86 9.78,23.5 10.16,23.88 12.57,23.88 12.83,24.13 12.83,25.78 R18.1 | 15.85,7.75 U3.1 | v12.83,42.16 14.64,42.16 D1.K
  Top 0.61: v8.64,19.68 8.76,19.81 8.76,22.35
  Top 0.762: R25.1 36.2,13.97 34.64,12.41 D6.A
  Top 0.813: 15.85,8.99 16.56,9.7 17.2,9.7 18.41,10.92 18.41,12.03 D4.K
  Top 1.016: D4.K 20.73,12.41 20.95,12.19 v20.95,11.68 20.95,11.56 C24.1 | FET1.1 40.15,7.49 v39.37,7.49 36.58,7.49 34.64,9.43 D6.A 33.53,12.06 v33.15,11.68
  Top 1.27: 15.85,8.99 15.85,7.75
  Bottom 0.508: 8.64,17.78 v8.64,19.68 | v12.83,42.16 4.45,42.16 1.02,38.73
  Bottom 0.762: v33.15,11.68 v20.95,11.68 18.29,11.68 12.19,17.78 8.64,17.78 1.78,17.78 v1.4,18.16 1.02,18.54 1.02,38.73
  Bottom 1.016: U$1.5V CON1.3 38.1,6.86 38.73,7.49 v39.37,7.49
  other vias: 19.43,3.94 18.29,3.94
  pour Top (isolate 0.305, no thermals): 17.78,5.08 17.78,0.76 23.5,0.76 23.5,5.08
  pour Bottom (isolate 0.305, no thermals): 17.78,5.08 17.78,0.76 23.5,0.76 23.5,5.08
+24V  (via drill 0.6)
  Top 0.508: C17.1 16.76,22.1 U2.6 | 18.35,26.23 R15.1 | CON3.14 8.38,24.51 8.76,24.13 v8.76,23.88 | R14.1 18.35,28.38 | v16.76,42.29 16.26,42.8 16.26,45.59 R2.2
  Top 0.61: D3.K 14.99,17.81 C17.1 11.43,20.32 C16.+ | U2.6 19.18,22.1 19.43,22.35 19.43,25.15 18.35,26.23 | 18.35,28.38 16,30.73 14.48,30.73 9.53,35.69 v9.53,37.34
  Top 1.27: R15.1 R14.1
  Bottom 0.508: v8.76,23.88 8.76,22.23 C16.+ | v9.53,37.34 9.53,39.5 11.05,41.02 13.46,41.02 14.73,42.29 v16.76,42.29
  Bottom 0.762: C16.+ 11.56,19.94 18.67,12.83 39.5,12.83 45.72,6.6
  Bottom 1.016: U$1.VIN CON1.6 45.72,6.6
A0  (via drill 0.6)
  Top 0.254: v34.16,20.95 34.16,21.46 35.05,22.35 35.05,25.15 35.23,25.32 U1.15
  Bottom 0.254: 50.8,7.11 50.8,8.26 42.93,16.13 42.93,18.41 41.27,20.07 35.05,20.07 v34.16,20.95
  Bottom 1.016: 50.8,7.11 CON2.1 U$1.A0
A1  (via drill 0.6)
  Top 0.254: v33.53,22.1 33.53,24.38 34.97,25.82 U1.14
  Bottom 0.254: 53.34,5.84 53.34,6.73 43.43,16.64 43.43,18.67 41.53,20.57 36.07,20.57 34.54,22.1 v33.53,22.1
  Bottom 1.016: U$1.A1 CON2.2 53.34,5.84
A2  (via drill 0.6)
  Top 0.254: v32.51,21.21 32.51,24.13 34.71,26.32 U1.13
  Bottom 0.254: v32.51,21.21 32.51,22.35 33.15,22.99 35.31,22.99 37.21,21.08 41.78,21.08 43.94,18.92 43.94,17.02 55.12,5.84
  Bottom 1.016: U$1.A2 CON2.3 55.12,5.84
A3  (via drill 0.6)
  Top 0.254: v37.34,22.35 37.72,22.73 37.72,24.89 38.35,25.53 38.35,26.42 37.85,26.92 36.96,26.92 36.86,26.82 U1.12
  Bottom 0.254: v37.34,22.35 38.1,21.59 42.04,21.59 44.45,19.18 44.45,17.4 54.36,7.49 57.4,7.49 58.04,6.86
  Bottom 1.016: U$1.A3 CON2.4 58.42,6.48 58.04,6.86
A4(SDA1)  (via drill 0.6)
  Top 0.254: v49.4,30.48 48.75,29.82 U1.43 | 53.85,17.02 54.48,17.65 54.48,18.54 54.99,19.05 57.15,19.05
  Top 0.508: 53.85,17.02 R12.1 53.34,15.49 52.7,14.86 50.42,14.86 49.91,15.37 49.91,16 R4.1
  Top 1.016: 57.15,19.05 UEXT.6
  Bottom 0.254: 59.56,24.13 54.36,24.13 53.47,25.02 53.47,28.96 51.94,30.48 v49.4,30.48
  Bottom 0.508: 60.07,7.62 60.07,20.32 60.07,23.62 59.56,24.13
  Bottom 1.016: U$1.A4 CON2.5 60.96,6.73 60.07,7.62 | UEXT.6 60.07,20.32
A5(SCL1)  (via drill 0.6)
  Top 0.254: U1.44 46.96,30.32 v46.48,29.84 | 57.15,21.59 59.82,21.59 | R11.1 52.45,17.91 52.45,15.75 52.2,15.49 50.8,15.49 50.55,15.75 50.55,17.65 R5.1
  Top 0.508: 62.23,7.62 62.23,19.18 59.82,21.59 | R11.1 54.86,20.32
  Top 1.016: 62.23,7.62 63.5,6.35 CON2.6 | 57.15,21.59 UEXT.5 54.86,20.32
  Bottom 0.254: 55.12,20.7 49.4,20.7 46.48,23.62 v46.48,29.84
  Bottom 1.016: CON2.6 U$1.A5 | UEXT.5 55.5,20.32 55.12,20.7
AGND  (via drill 0.6, 0.6 pad 0.41)
  Top 0.254: C6.2 39.79,21.5 U1.20
  Top 0.406: C28.2 34.92,41.53 v36.07,41.53 | v31.88,25.91 31.88,25.53 30.61,24.26 30.61,20.32 33.02,17.91 36.2,17.91 C6.2
  Top 0.508: SR1.3 18.63,41.91 20.19,41.91 | 20.19,41.91 20.45,41.91 R7.1 | 34.54,41.4 C28.2 | VR2(3.3V).1 29.64,42.49 v29.97,42.16 C14.2 30.86,41.4 | CON3.19 2.03,19.43 2.16,19.3 4.06,19.3 v4.32,19.05 | v16.76,33.91 16.76,34.16 17.78,35.18 R22.2 18.03,36.07 18.41,36.45 19.68,36.45 20.19,36.96 20.19,41.91
  Top 0.762: C15.2 24.51,41.66 v24.51,42.42 24.38,42.55 R7.1
  Top 1.016: 34.54,41.4 C27.2 30.86,41.4
  Bottom 0.406: v31.88,25.91 31.88,26.67 36.45,31.24 36.45,41.15 v36.07,41.53
  Bottom 0.508: v24.51,42.42 29.72,42.42 v29.97,42.16 | v4.32,19.05 1.91,21.46 1.91,32.77 2.92,33.78 7.49,33.78 8.26,34.54 16.13,34.54 v16.76,33.91
AREF  (via drill 0.6)
  Top 0.254: 19.56,48.13 19.56,44.09 SR1.1 | R1.2 35.81,21.46 35.81,24.81 36.07,24.81 U1.16 36.89,24.82 37.47,25.4 v37.47,26.04
  Top 0.406: v37.72,46.23 24.89,46.23 24.38,46.74
  Top 1.016: R2.1 R3.1 19.56,48.13 R6.2 22.86,48.13 CON5.8 24.38,46.74
  Bottom 0.406: v37.72,46.23 38.1,45.85 38.1,30.73 35.81,28.45 35.81,27.56 35.81,26.67 36.45,26.04 v37.47,26.04
  Bottom 1.27: U$1.AREF 22.86,49.78 CON5.8
D0(RXD1)
  Top 0.254: U1.50 45.29,38.43 51.31,44.45 59.69,44.45 62.61,47.37
  Top 1.016: 62.61,47.37 CON4.1
  Bottom 1.27: CON4.1 U$1.D0
D1(TXD1)
  Top 0.254: U1.51 44.79,38.82 50.93,44.96 57.66,44.96 60.07,47.37
  Top 1.016: 60.07,47.37 CON4.2
  Bottom 1.27: CON4.2 U$1.D1
D2(BUT)  (via drill 0.6)
  Top 0.254: 57.53,47.37 55.63,45.47 50.67,45.47 44.29,39.08 U1.52 44.29,33.69 44.45,33.53 45.59,33.53 45.97,33.15 45.97,32.13 46.78,31.32 U1.46 | 15.11,48.13 R17.2 15.24,48.26 14.99,48.51 14.63,48.51 13.99,49.15 12.83,49.15 v12.57,49.4
  Top 0.406: BUT.2_1 1.91,49.28 2.41,48.77 5.33,48.77 6.1,49.53 8.13,49.53 v8.26,49.4
  Top 1.016: CON4.3 57.53,47.37 | R17.2 C20.1
  Bottom 0.254: v12.57,49.4 13.84,48.13 19.05,48.13
  Bottom 0.406: v8.26,49.4 v12.57,49.4 | 57.4,51.82 56.77,52.45 23.37,52.45 19.05,48.13
  Bottom 1.016: 57.4,51.82 U$1.D2
  Bottom 1.27: U$1.D2 CON4.3
D3
  Top 0.254: U1.53 43.79,39.34 50.42,45.97 53.59,45.97 54.99,47.37
  Top 1.016: 54.99,47.37 CON4.4
  Bottom 1.27: CON4.4 U$1.D3
D4
  Top 0.254: U1.54 43.29,39.6 50.16,46.48 51.56,46.48 52.45,47.37
  Top 1.016: 52.45,47.37 CON4.5
  Bottom 1.27: CON4.5 U$1.D4
D5
  Top 0.254: U1.55 42.79,39.87 50.04,47.12 50.55,47.12 50.8,47.37
  Top 1.016: 50.8,47.37 CON4.6
  Bottom 1.27: CON4.6 U$1.D5
D6  (via drill 0.6)
  Top 0.254: U1.42 49.77,29.32 50.42,29.97 50.42,33.27 v50.04,33.66
  Bottom 0.254: v50.04,33.66 50.55,33.66 53.09,36.2 53.09,42.42 48.26,47.24
  Bottom 1.016: 48.26,47.24 CON4.7
  Bottom 1.27: CON4.7 U$1.D6
D7  (via drill 0.6)
  Top 0.254: U1.45 46.39,30.82 45.47,31.75 45.47,32.26 v45.09,32.64
  Bottom 0.254: v45.09,32.64 47.12,34.67 47.12,35.94 45.72,37.34 45.72,47.12
  Bottom 1.016: 45.72,47.12 CON4.8
  Bottom 1.27: CON4.8 U$1.D7
D8  (via drill 0.6)
  Top 0.254: U1.29 44.29,24.09 44.83,24.64 44.83,26.92 v41.66,30.1
  Bottom 0.254: v41.66,30.1 42.04,30.48 42.04,38.48 39.37,41.15 39.37,45.85 40.64,47.12
  Bottom 1.016: 40.64,47.12 CON5.1
  Bottom 1.27: U$1.D8 40.64,49.78 CON5.1
D9  (via drill 0.6)
  Top 0.254: U1.30 44.79,23.83 45.34,24.38 45.34,27.43 42.55,30.23 42.55,30.86 42.29,31.11 v40.89,31.11
  Bottom 0.254: v40.89,31.11 41.53,31.75 41.53,38.23 38.73,41.02 38.73,46.86 38.1,47.5
  Bottom 1.016: 38.1,47.5 CON5.2
  Bottom 1.27: U$1.D9 38.1,49.78 CON5.2
D10(#SS)  (via drill 0.6)
  Top 0.254: v29.97,28.45 33.4,28.45 33.78,28.82 U1.8
  Top 0.762: v50.16,13.72 G9/F0.3
  Bottom 0.254: 31.37,28.45 32.77,28.45 35.18,30.86 35.18,46.48 35.56,46.86 35.56,47.12 | v50.16,13.72 48.9,13.72 47.88,14.73 47.88,18.29 42.42,23.75 42.42,24.89 41.78,25.53 38.99,25.53 38.48,25.02 31.5,25.02 30.99,25.53 30.99,26.8 31.37,27.18 31.37,28.45 | 31.37,28.45 v29.97,28.45
  Bottom 1.016: 35.56,47.12 CON5.3
  Bottom 1.27: U$1.D10 35.56,49.78 CON5.3
D11(MOSI)  (via drill 0.6)
  Top 0.254: v32.77,29.72 32.87,29.82 U1.6 39.14,29.82 41.53,27.43 v41.53,26.92
  Bottom 0.254: v32.77,29.72 34.67,31.62 34.67,46.61 33.78,47.5 | v41.53,26.92 42.29,27.69 44.45,27.69 45.85,26.29 45.85,23.5 49.15,20.19 53.98,20.19 55.12,19.05 57.15,19.05
  Bottom 1.016: 33.78,47.5 CON5.4 | 57.15,19.05 UEXT.8
  Bottom 1.27: U$1.D11 33.02,49.78 CON5.4
D12(MISO)  (via drill 0.6)
  Top 0.254: v31.5,29.46 31.5,29.72 32.38,30.61 33.91,30.61 34.19,30.32 U1.5 39.4,30.32 42.8,26.92 v42.8,26.8
  Bottom 0.254: v31.5,29.46 31.5,29.72 34.16,32.38 34.16,44.58 30.99,47.75 | v42.8,26.8 44.45,26.8 45.34,25.91 45.34,23.24 48.9,19.68 53.09,19.68 54.36,18.41
  Bottom 1.016: 30.99,47.75 CON5.5 | 54.36,18.41 54.99,17.78 UEXT.7
  Bottom 1.27: U$1.D12 30.48,49.78 CON5.5
D13(SCK/LED1)  (via drill 0.6)
  Top 0.254: v31.24,30.73 31.62,31.11 34.29,31.11 34.58,30.82 U1.4 39.66,30.82 42.8,27.69 43.18,27.69 43.94,26.92 v43.94,25.91 | LED1_E.2 9.27,48.51 v7.24,48.51
  Bottom 0.254: v31.24,30.73 33.66,33.15 33.66,44.07 30.86,46.86 27.94,46.86 18.92,46.86 18.67,47.12 13.21,47.12 11.81,48.51 v7.24,48.51 | v43.94,25.91 43.94,23.88 48.64,19.18 52.2,19.18 55.37,16
  Bottom 1.016: 55.37,16 55.88,15.49 UEXT.9 | 27.94,46.86 CON5.6
  Bottom 1.27: U$1.D13 27.94,49.78 CON5.6
D+
  Top 0.254: USB.D+ 7.41,41.53 8.51,41.53 8.89,41.15 8.89,40.77 10.92,38.73 10.92,36.07 14.99,32 26.92,32 28.57,33.66 36.83,33.66 37.97,32.51 43.94,32.51 45.59,30.86 45.59,29.46 46.99,28.07 46.99,27.05 47.22,26.82 U1.37
D-
  Top 0.254: USB.D- 5.8,42.46 5.46,42.11 5.46,39.88 7.11,38.23 10.03,38.23 10.41,37.85 10.41,35.81 14.73,31.5 27.18,31.5 28.83,33.15 36.58,33.15 37.72,32 43.69,32 45.09,30.61 45.09,29.21 46.48,27.81 46.48,26.67 46.83,26.32 U1.36
GND  (via drill 0.6, 0.6 pad 0.41)
  Top 0.254: 42.67,19.69 42.29,20.07 U1.25 | C3.2 29.08,27.56 30.61,27.56 30.99,27.94 33.66,27.94 34.04,28.32 U1.9 | U1.41 50.16,28.82 51.05,29.72 | 51.05,35.43 51.05,34.95 49.55,34.95 49.15,34.54 49.15,33.27 49.78,32.64 49.78,31.88 49.28,31.37 | 47.5,33.02 47.12,33.02 46.86,32.77 46.86,32
  Top 0.406: 43.31,19.05 42.67,19.69 | v8.38,39.12 8.38,39.75 8.08,40.06 USB.GND | v5.71,34.8 4.7,34.8 C13.2 | 51.05,36.07 51.05,35.43 51.05,29.72 | 52.96,36.07 51.05,36.07 | v12.57,52.45 11.68,52.45 LED1.C | C29.2 19.18,6.1 v17.02,6.1 16.89,6.22 U3.2 | 50.55,20.83 50.55,20.19 50.16,19.81 46.99,19.81 46.35,19.18 46.35,18.41 45.59,17.65 | 59.18,38.73 59.18,38.99 56.52,38.99 56.01,38.48 52.2,38.48 51.05,37.34 51.05,36.07 | 26.92,25.02 27.56,24.38 27.56,22.35 28.83,21.08 v28.83,18.8 | 51.56,41.78 48.64,38.86 48.64,37.21 47.5,36.07 47.5,33.02 | 57.15,27.43 54.36,27.43 53.47,26.54 53.47,22.23 | 54.23,34.92 53.21,33.91 53.21,32
  Top 0.508: C10.1 C9.1 53.34,41.78 | C4.2 43.31,19.05 | C1.- 38.73,40.13 38.73,41.91 C2.2 38.86,43.81 | 11.56,45.09 C11.1 | 53.34,41.78 57.02,41.78 59.18,39.62 59.18,38.73 59.18,35.69 v58.42,34.92 54.23,34.92 54.1,34.92 52.96,36.07 | 53.34,41.78 v52.2,41.78 51.56,41.78 | 23.75,23.37 U2.4 | 20.19,33.4 R22.1 17.4,32.77 15.11,32.77 11.81,36.07 v11.81,39.62 11.56,39.88 11.56,45.09 | 20.19,33.4 C25.2 22.61,33.66 22.99,33.66 23.62,34.29 v23.62,34.8 | 20.19,33.4 C26.2 | C5.2 50.55,20.83 C12.1 | C4.2 44.45,17.65 45.59,17.65 | 26.92,25.02 D5.A | LED2.C 20.83,52.2 26.42,52.2 42.93,52.2 43.94,51.18 43.94,45.85 | U3.2 14.96,6.22 13.95,7.24 C30.2 | v37.72,15.49 37.72,14.48 R25.2 v37.97,11.68 | C3.2 28.7,29.34 v29.08,29.72 | v32.51,43.81 38.86,43.81 | C29.2 R23.1 | C24.2 24.13,10.92 v24.13,8 | 14.35,22.1 14.35,26.29 R21.2 | CON3.18 4.83,21.97 v4.45,22.35 4.19,22.35 3.3,23.24 CON3.15 | v41.78,18.29 42.8,18.29 C4.2 | 43.94,45.85 v46.74,45.85 | 38.86,43.81 43.31,43.81 43.94,44.45 43.94,45.85 | 17.25,39.75 VR1(3.3V).1 | v12.83,45.47 12.83,45.85 13.46,46.48 C20.2 | v12.83,45.47 12.83,44.32 R20.1 | 11.56,45.09 11.94,45.47 v12.83,45.47 | 9.7,18.63 9.61,18.54 6.1,18.54 v5.71,18.92
  Top 0.61: PWR_J.- 8.18,13.01 9.7,14.53 9.7,18.63 9.7,21.26 10.54,22.1 11.05,22.1
  Top 0.762: 23.75,23.37 23.75,27.3 24.26,27.81 24.64,27.81 24.77,27.94 C23.2 25.27,27.81 26.04,27.81 26.42,27.43 26.92,27.43 | PWR_LED.C 8.14,2.29 3.7V-LI_BAT.2 5.19,3.83 4.19,4.83 X1.2 | 26.92,27.43 27.56,27.43 27.94,27.81 28.57,27.81 C3.2 | D5.A 26.92,27.43 | C18.- 24.64,12.95 24.64,11.68 C24.2 | PWR_J.-- 10.16,7.49 10.54,7.11 13.72,7.11 C30.2 | C17.2 14.35,22.1 11.05,22.1 C16.- | C19.2 18.92,39.75 v18.16,39.75 17.25,39.75
  Top 1.016: C8.1 C7.1 57.15,27.43 58.42,26.16 UEXT.2 | 59.18,38.73 U$1.GND@3 | R19.1 C21.2 24.13,7.11 v24.13,8 | 26.42,52.2 U$1.GND@2
  Bottom 0.406: v12.83,45.47 8.51,45.47 6.22,47.75 6.22,50.04 8.64,52.45 v12.57,52.45
  Bottom 0.508: 8.38,36.32 v8.38,39.12 | v23.62,34.8 28.83,40.01 33.02,40.01 | v29.08,29.72 29.08,30.1 30.73,31.75 30.99,31.75 33.02,33.78 33.02,40.01 | 33.02,40.01 33.02,43.31 v32.51,43.81 | 11.81,38.1 10.03,36.32 8.38,36.32 | 8.38,36.32 5.71,36.32 v5.71,34.8 | 11.81,38.61 13.84,38.61 15.62,40.39 17.53,40.39 v18.16,39.75 | v17.02,6.1 22.23,6.1 v24.13,8 | v37.97,11.68 40.64,9.02 | v46.74,45.85 50.8,41.78 v52.2,41.78 | v5.71,18.92 5.71,21.08 v4.45,22.35
  Bottom 0.762: 37.72,19.18 29.21,19.18 v28.83,18.8 28.83,18.41 24.77,14.35 C18.- 18.8,14.35 12.83,20.32 12.83,20.7 C16.- | 37.72,19.18 v37.72,15.49 | v41.78,18.29 40.89,19.18 37.72,19.18 | 11.81,38.1 11.81,38.61 v11.81,39.62
  Bottom 1.016: U$1.GND@1 CON1.5 CON1.4 | CON1.4 U$1.GND | v58.42,34.92 UEXT.2 | 40.64,9.02 CON1.4
  Bottom 1.27: U$1.GND@2 25.4,49.78 CON5.7 | X1.2 4.19,11.3 5.89,13.01 PWR_J.- 8.08,13.01 10.16,10.92 PWR_J.--
  other vias: 45.97,10.03 53.59,9.78 56.64,10.67 43.69,49.53 11.18,16.51 66.93,31.5 64.39,29.34 64.14,24.64
  pour Top (isolate 0.305, no thermals): 12.95,6.48 12.95,10.54 15.88,10.54 15.88,7.24 18.16,7.24 18.16,10.54 21.59,10.54 21.59,5.84 13.59,5.84
  pour Bottom (isolate 0.381, rank 2): -11.94,62.87 74.42,62.87 74.42,-14.1 -11.94,-14.1
  pour Top (isolate 0.406, rank 2): -3.43,57.15 69.6,57.15 69.6,-4.57 -3.43,-4.57
LED2  (via drill 0.6)
  Top 0.254: R10.2 20.95,49.53 42.04,49.53 42.8,48.77 v42.8,44.96 | U1.49 45.79,35.12 v46.23,35.56
  Bottom 0.254: v42.8,44.96 44.45,43.31 44.45,37.34 v46.23,35.56
N$1  (via drill 0.6)
  Top 0.254: U1.11 34.56,27.32 34.16,26.92 31.62,26.92 v30.1,25.4
  Top 0.508: CON3.13 3.3,24.51 4.06,23.75 v4.32,23.75
  Bottom 0.254: v4.32,23.75 3.43,24.64 3.43,26.54 4.06,27.18 8.26,27.18 8.89,26.54 10.67,26.54 11.05,26.92 12.32,26.92 13.08,27.69 21.46,27.69 22.48,26.67 28.32,26.67 29.59,25.4 v30.1,25.4
N$2
  Top 1.016: LED1_E.1 11.18,49.91 R9.2
N$3
  Top 0.254: U1.21 40.29,21.24 38.35,19.3 38.35,17.65 40.39,15.62 46.74,15.62 R4.2
N$4  (via drill 0.6)
  Top 0.508: R8.1 v61.34,33.02
  Bottom 0.508: v61.34,33.02 62.74,34.42 62.74,40.51 61.98,41.27
  Bottom 1.016: 61.98,41.27 U$1.RESET
N$5
  Top 1.016: R10.1 LED2.A
N$6
  Top 0.254: U1.22 40.79,20.98 38.99,19.18 38.99,17.78 40.64,16.13 44.96,16.13 R5.2
N$7
  Top 1.016: D4.A 19.21,16.89 C18.+
  Top 1.27: C18.+ 24.38,16.89 25.65,15.62 L1.2
N$8
  Top 0.508: PWR_LED.A R24.2
N$9  (via drill 0.6, 1.02 pad 1.78)
  Top 0.254: U1.24 41.79,20.45 40.89,19.56 40.89,17.27 v41.02,17.14
  Bottom 0.254: 27.94,1.52 28.83,0.64 46.99,0.64 47.88,1.52 47.88,6.86 41.02,13.72 v41.02,17.14
  Bottom 1.016: 27.94,2.67 A6.P$1 | 27.94,2.67 v27.94,5.08 | 27.94,1.52 27.94,2.67
N$10  (via drill 0.6, 1.02 pad 1.78)
  Top 0.254: U1.23 41.29,20.71 40.01,19.43 v40.01,18.03
  Bottom 0.254: v40.01,18.03 40.01,13.97 47.37,6.6 47.37,1.78 46.74,1.14 31.11,1.14 30.73,1.52 30.48,1.52
  Bottom 1.016: v30.48,5.08 A7.P$1 30.48,1.52
N$11
  Top 0.508: RST.1_1 25.91,1.14 26.16,1.4 26.16,4.57 R19.2
N$12  (via drill 0.6)
  Top 0.508: BUT.1_1 2.16,51.94 3.43,51.94 v3.94,51.44 | v14.15,45.19 14.25,45.19 14.73,44.7 14.73,44.2 R20.2
  Bottom 0.406: v3.94,51.44 2.92,50.42 2.92,48.01 6.48,44.45 13.41,44.45 v14.15,45.19
N$13
  Top 0.61: D3.A 14.83,13.08 13.54,13.08 PWR_J.+
  Bottom 1.27: X1.1 4.99,16.38 8.38,16.38 11.76,13.01 PWR_J.+
N$14  (via drill 0.6)
  Top 0.254: U1.27 43.29,23.39 42.67,24 v41.02,24
  Top 0.508: CON3.12 10.92,25.78 v11.81,24.89
  Bottom 0.254: v11.81,24.89 12.83,24.89 14.1,26.16 20.7,26.16 21.72,25.15 27.56,25.15 29.21,23.5 38.99,23.5 39.24,23.24 40.26,23.24 v41.02,24
N$15  (via drill 0.6)
  Top 0.254: v39.75,24.13 40.51,24.89 42.67,24.89 43.79,23.78 U1.28
  Top 0.508: CON3.11 3.43,25.78 4.19,25.02 v4.45,25.02
  Bottom 0.254: v4.45,25.02 5.21,25.78 8.13,25.78 8.38,25.53 11.18,25.53 11.56,25.91 12.83,25.91 13.59,26.67 20.95,26.67 21.97,25.65 27.81,25.65 29.46,24 39.62,24 v39.75,24.13
N$16
  Top 0.254: U1.56 42.29,36.33 42.29,36.32 42.29,38.99 41.53,39.75 C1.+
  Top 0.508: C1.+ 41.15,41.53 C2.1
N$17
  Top 0.254: U1.39 50.91,27.82 52.07,26.67
  Top 0.406: 52.07,26.67 Q1.2
  Top 0.762: 52.07,26.67 54.1,28.7 C7.2
N$18  (via drill 0.6)
  Top 0.254: U1.59 40.79,33.67 40.51,33.4 37.97,33.4 36.7,34.67 v31.24,34.67
  Top 0.508: CON3.10 9.02,27.05 v9.91,27.94
  Bottom 0.254: v9.91,27.94 11.81,27.94 12.57,28.7 21.97,28.7 22.86,27.81 24.89,27.81 26.54,29.46 26.54,29.72 31.24,34.42 v31.24,34.67
N$19
  Top 0.254: U1.40 50.93,28.32 51.69,29.08 51.69,30.61 52.07,30.99
  Top 0.406: 52.07,30.99 Q1.1
  Top 0.762: 52.07,30.99 C8.2
N$20
  Top 0.254: U1.47 48.84,31.82 49.02,32 49.02,32.61 48.64,32.99 48.64,35.18 49.4,35.94 Q2.2 49.91,37.08 51.94,39.12 55.63,39.12 C10.2
N$21
  Top 0.254: Q2.1 49.28,37.85 49.28,36.96 48.13,35.81 48.13,32.33 | 47.88,32.33 U1.48 48.13,32.33 | 48.13,32.33 48.26,32.33
  Top 0.508: Q2.1 C9.2
N$22
  Top 0.508: U3.5 18.45,8.35 R23.2
N$23
  Top 1.016: R9.1 9.27,50.29 LED1.A
N$24  (via drill 0.6)
  Top 0.254: v44.32,20.57 45.47,20.57 47.37,22.48 49.15,22.48 49.78,23.11 49.78,24.38 49.34,24.82 U1.33
  Top 0.508: CON3.9 3.68,27.05 v4.45,26.29
  Bottom 0.254: v4.45,26.29 8.38,26.29 8.64,26.04 10.92,26.04 11.3,26.42 12.57,26.42 13.34,27.18 21.21,27.18 22.23,26.16 28.07,26.16 29.72,24.51 38.73,24.51 39.24,25.02 41.27,25.02 41.91,24.38 41.91,22.99 v44.32,20.57
N$25  (via drill 0.6)
  Top 0.254: U1.60 40.29,36.67 39.37,37.59 29.46,37.59 27.81,35.94 25.65,35.94 24.89,35.18 24.89,33.91 v24,33.02
  Top 0.508: CON3.1 3.94,32.13 v4.19,31.88
  Bottom 0.254: v4.19,31.88 4.7,32.38 8.26,32.38 9.02,33.15 14.73,33.15 15.62,32.26 23.24,32.26 v24,33.02
N$26  (via drill 0.6)
  Top 0.254: U1.61 39.79,36.41 39.12,37.08 29.72,37.08 28.07,35.43 26.42,35.43 v25.78,34.8
  Top 0.508: CON3.2 8.26,32.13 v8.76,31.62
  Bottom 0.254: v8.76,31.62 9.78,32.64 14.48,32.64 15.37,31.75 24,31.75 25.02,32.77 25.02,34.04 v25.78,34.8
N$27  (via drill 0.6)
  Top 0.254: U1.62 39.29,36.15 38.86,36.58 29.97,36.58 27.94,34.54 v27.18,34.54
  Top 0.508: 1.91,30.86 CON3.3 3.94,30.86 v4.19,30.61
  Bottom 0.254: v4.19,30.61 9.02,30.61 10.54,32.13 14.22,32.13 15.11,31.24 24.26,31.24 25.65,32.64 25.65,33.4 26.8,34.54 v27.18,34.54
N$28  (via drill 0.6)
  Top 0.254: U1.63 38.79,35.89 38.61,36.07 30.23,36.07 27.18,33.02 v26.54,33.02
  Top 0.508: CON3.4 7.62,30.86 7.87,30.61 10.29,30.61 v10.92,31.24
  Bottom 0.254: v10.92,31.24 14.35,31.24 14.86,30.73 24.51,30.73 26.54,32.77 v26.54,33.02
N$29  (via drill 0.6)
  Top 0.254: v29.97,34.54 29.97,35.05 30.48,35.56 38.16,35.56 38.29,35.43 U1.64
  Top 0.508: CON3.5 3.43,29.59 3.68,29.34 v4.32,29.34
  Bottom 0.254: v4.32,29.34 5.08,30.1 9.27,30.1 9.53,30.35 14.35,30.35 14.48,30.23 24.77,30.23 25.53,30.99 26.92,30.99 29.97,34.04 v29.97,34.54
N$30  (via drill 0.6)
  Top 0.254: v25.65,29.84 26.29,29.84 29.08,32.64 35.31,32.64 35.62,32.33 U1.1
  Top 0.508: CON3.6 10.79,29.59 v10.92,29.46
  Bottom 0.254: v10.92,29.46 11.18,29.72 25.53,29.72 v25.65,29.84
N$31  (via drill 0.6)
  Top 0.254: U1.2 35.23,31.82 34.92,32.13 29.34,32.13 26.16,28.96 23.5,28.96 v23.24,28.7
  Top 0.508: CON3.7 3.94,28.32 v4.19,28.07
  Bottom 0.254: v4.19,28.07 4.32,28.07 5.84,29.59 9.53,29.59 10.54,28.57 11.43,28.57 12.06,29.21 22.73,29.21 v23.24,28.7
N$32  (via drill 0.6)
  Top 0.254: U1.3 34.84,31.32 34.54,31.62 29.72,31.62 27.05,28.96 v27.05,28.57
  Top 0.508: CON3.8 8,28.32 8.26,28.57 v8.76,28.57
  Bottom 0.254: v8.76,28.57 8.76,27.81 9.53,27.05 10.41,27.05 10.79,27.43 12.06,27.43 12.83,28.19 21.72,28.19 22.73,27.18 25.65,27.18 v27.05,28.57
N$33
  Top 0.508: U2.3 24.38,22.1 25.15,22.86 C23.1
N$34  (via drill 0.6, 0.6 pad 0.41)
  Top 0.406: 15.75,37.08 v17.53,37.08 17.78,37.34 18.8,37.34 C19.1
  Top 0.508: VR1(3.3V).P$2 15.75,37.08 VR1(3.3V).2 | 27.18,40.01 VR2(3.3V).2 | 27.18,40.01 VR2(3.3V).P$2 27.18,37.85 v23.5,37.85 | 27.18,40.01 30.35,40.01 C14.1
  Top 0.762: D6.K 39.5,12.06 | v36.83,10.41 38.48,10.41 39.53,11.46 D6.K | D6.K 39.53,12.35 40.77,13.59 43.2,13.59 FET1.2 | v6.99,34.8 9.02,34.8 14.1,29.72 15.37,29.72 16.51,28.57 16.51,25.02 v16,24.51
  Top 1.016: v16,10.92 16.76,10.92 17.14,11.3 17.14,18.34 v17.3,18.49
  Bottom 0.762: v16,10.92 16.38,10.54 21.46,10.54 21.59,10.67 30.35,10.67 30.61,10.41 v36.83,10.41 | v23.5,37.85 22.61,37.85 21.84,37.08 v17.53,37.08 12.7,37.08 11.05,35.43 7.62,35.43 v6.99,34.8
  Bottom 1.016: v17.3,18.49 16.43,18.49 14.22,20.7 14.22,23.5 15.24,24.51 v16,24.51
  other vias: 13.08,37.08 14.1,35.94 14.1,37.08
  pour Top (isolate 0.508): 12.7,38.73 19.05,38.73 19.05,33.02 12.7,33.02
  pour Bottom (isolate 0.508): 23.5,42.55 18.41,42.55 17.14,41.27 15.88,41.27 10.16,35.56 10.16,33.02 23.5,33.02
N$35
  Bottom 1.016: 13.46,11.3 13.46,14.86
N$36
  Top 0.254: SR1.2 17.34,43.62 18.29,42.67 19.94,42.67 20.19,42.93 20.19,43.43 R7.2
  Top 1.016: R6.1 21.08,45.72 R7.2
N$37
  Bottom 1.016: 6.99,11.43 6.99,14.61
N$38  (via drill 0.6)
  Top 0.254: v40.64,37.59 41.29,36.95 U1.58 | G9/F0.1 52.45,13.72
  Top 0.762: v55.24,12.95 54.48,13.72 G9/F0.1
  Bottom 0.254: v40.64,37.59 40.64,32.38 36.58,28.32 36.58,27.43 37.08,26.92 38.61,26.92 39.5,26.04 42.29,26.04 43.18,25.15 43.18,23.88 48.51,18.54 51.94,18.54 53.72,16.76 53.72,14.48 v55.24,12.95
N$39
  Bottom 1.016: 8.64,8.51 11.68,8.51
N$61
  Top 0.254: 14.48,27.69 15.11,27.05 15.11,23.88 15.62,23.37
  Top 0.508: R18.2 R21.1 14.48,27.69
  Top 0.762: 15.62,23.37 U2.5
N$64  (via drill 0.6)
  Top 0.406: U2.7 16.64,20.83 16.38,20.57 16.38,19.81 16.64,19.56 U2.8
  Top 0.508: R14.2 R15.2 21.21,26.23 v21.21,23.11 21.21,22.23 19.81,20.83 U2.7 | U2.8 U2.1
  other vias: 19.56,20.57 20.57,18.29 25.4,18.54 20.95,20.57 21.21,21.84 19.56,19.43 20.95,19.43
  pour Top (isolate 0.305, no thermals): 13.34,17.78 13.34,30.35 13.97,30.99 27.56,30.99 27.56,17.78
  pour Bottom (isolate 0.305, no thermals): 13.34,25.02 33.53,25.02 33.53,21.72 32,20.19 29.59,20.19 25.53,16.13 13.34,16.13
N$67
  Top 0.508: D5.K 26.83,20.16
  Top 0.762: 26.16,20.83 U2.2
  Top 1.016: 26.83,20.16 26.16,20.83 | D5.K 26.96,20.16 26.96,18.38 27.81,17.53 30.48,17.53 31.34,16.66 L1.1
PGEC2  (via drill 0.6)
  Top 0.254: U1.17 38.29,24.7 38.86,25.27 38.86,26.67 37.59,27.94 v37.47,27.94 | v46.74,38.61 46.74,38.99 51.31,43.56 61.21,43.56 63.12,41.66 63.12,36.7 62.61,36.2
  Top 1.016: 62.61,36.2 U$1.PGC
  Bottom 0.254: v37.47,27.94 37.47,28.32 38.35,29.21 42.93,29.21 47.62,33.91 47.62,36.2 46.48,37.34 46.48,38.35 v46.74,38.61
PGED2  (via drill 0.6)
  Top 0.254: U1.18 38.79,24.44 39.37,25.02 39.37,27.43 v38.73,28.07 | v47.5,37.59 47.62,37.72 47.62,38.99 51.56,42.93 61.09,42.93 62.48,41.53 62.48,37.72 62.23,37.47
  Top 1.016: 62.23,37.47 U$1.PGD
  Bottom 0.254: v38.73,28.07 39.37,28.7 43.18,28.7 48.13,33.66 48.13,36.58 47.5,37.21 v47.5,37.59
RESET  (via drill 0.6)
  Top 0.254: U1.7 38.87,29.32 40.26,27.94 v40.26,27.43
  Top 0.406: v27.05,6.86 27.05,8.05 D2.A
  Top 0.508: R8.2 55.37,32.77 56.13,32 v59.69,32 | v61.09,13.08 56.39,8.38 44.7,8.38 42.8,6.48 34.42,6.48
  Top 0.762: 23.88,3.94 v24.38,3.94
  Top 1.016: RST.2_1 23.88,2.67 23.88,3.94 C21.1 R16.2 | R8.2 v54.23,33.02 | CON1.1 34.42,6.48
  Bottom 0.254: v40.26,27.43 40.26,27.81 40.64,28.19 43.43,28.19 48.01,32.77 53.98,32.77 v54.23,33.02
  Bottom 0.508: v61.09,13.08 61.09,30.61 v59.69,32
  Bottom 1.016: U$1.RST CON1.1 33.02,5.59 31.75,6.86 v27.05,6.86 26.16,6.86 24.38,5.08 v24.38,3.94
RX2  (via drill 0.6)
  Top 0.254: U1.31 45.29,23.42 45.74,23.88 v47.62,23.88
  Bottom 0.254: v47.62,23.88 47.62,23.24 49.28,21.59 57.15,21.59
  Bottom 1.016: 57.15,21.59 UEXT.4
TX2  (via drill 0.6)
  Top 0.254: U1.32 45.79,22.93 45.85,22.99 48.27,22.99 48.65,23.37 v48.77,23.37
  Bottom 0.762: v48.77,23.37 49.28,22.86 53.85,22.86
  Bottom 1.016: 53.85,22.86 UEXT.3
UEXT_#CS
  Top 0.508: R13.1 55.5,11.56 57.15,13.21
  Top 0.762: G9/F0.2 52.45,12.83 53.34,11.94 R13.1
  Top 1.016: 57.15,13.21 58.42,14.48 UEXT.10
USB_POWER  (via drill 0.6, 0.6 pad 0.41)
  Top 0.254: U1.34 46.94,25.32 45.97,26.29 45.97,27.56 43.43,30.1 v43.43,30.99
  Top 0.406: 9.14,43.43 v9.02,43.43 | 7.49,43.43 7.49,43.26 USB.VBUS
  Top 0.508: v22.35,43.69 23.62,44.96 v40.39,44.96
  Top 0.762: C11.2 9.02,44.58 v9.02,43.43 7.49,43.43 | 9.14,43.43 9.53,43.05 9.53,42.39 D1.A
  Bottom 0.508: v9.02,43.43 9.14,43.31 21.97,43.31 v22.35,43.69 | v40.39,44.96 40.39,41.15 42.67,38.86 42.67,31.75 v43.43,30.99
USB_SHIELD
  Top 0.813: C13.1 2.79,36.71
  Top 1.016: USB.GND2 USB.GND1 USB.GND3 2.79,36.71 USB.GND4
VBAT  (via drill 0.6 pad 0.41)
  Top 0.762: U3.3 14.03,5.27 C30.1 12.83,5.46 12.46,5.83 3.7V-LI_BAT.1 | v38.73,9.27 40.01,9.27 41.57,10.84 FET1.3
  Bottom 0.508: 21.97,9.53 22.23,9.78 25.27,9.78 25.78,9.27 | 3.7V-LI_BAT.1 6.6,5.84
  Bottom 0.762: 21.97,9.53 14.86,9.53 11.18,5.84 6.6,5.84 | 25.78,9.27 v38.73,9.27
  other vias: 2.54,5.59 2.54,4.19 3.3,3.17 4.57,2.67 12.45,5.59
  pour Top (isolate 0.305): 0.51,7.37 0.51,0.76 12.57,0.76 12.57,5.33 10.54,7.37
  pour Bottom (isolate 0.305, no thermals): 0.25,7.75 10.54,7.75 12.57,5.71 12.57,0.64 0.25,0.64
VCC  (via drill 0.6)
  Top 0.254: U1.10 34.3,27.82 33.91,27.43 31.24,27.43 30.48,26.67 v29.97,26.67 29.34,26.67 28.83,26.16 C3.1 | C4.1 44.2,19.68 43.69,19.68 42.79,20.59 U1.26 | 53.09,21.34 52.7,21.72 51.05,21.72 50.93,21.84 50.93,25.4 49,27.32 U1.38 | 50.42,21.84 50.42,25.02 49.61,25.82 U1.35 | U1.57 41.79,38.35 41.4,38.73 40.01,38.73 39.5,38.23 | 25.15,36.45 27.56,36.45 28.96,37.85 v28.96,38.35
  Top 0.406: v28.96,38.35 28.96,38.23 39.5,38.23 | 25.15,36.45 v23.62,36.45 22.35,36.45
  Top 0.508: v13.34,39.62 14.25,39.62 VR1(3.3V).3 | 22.1,9.45 D2.C | L2.1 22.35,37.11 22.35,36.45 C25.1 20.32,35.18 C26.1 | 53.34,20.7 C12.2 53.09,20.83 | 54.74,24.51 54.23,24 54.23,21.84 53.72,21.34 53.09,21.34 53.09,20.83 | C4.1 45.09,19.05 46.61,20.57 47.37,20.57 C5.1 47.88,21.08 47.88,21.84 50.42,21.84 50.93,21.84 | C3.1 28.57,26.04 | R11.2 51.82,19.05 51.82,19.18 53.09,20.45 53.09,20.83 | R13.2 51.56,11.68 | CON3.17 3.3,21.97 4.32,20.95 v4.32,20.83 | R17.1 13.46,48.26 12.7,48.26 12.32,47.88 12.32,46.86 v12.06,46.61
  Top 0.762: 33.02,16.64 29.72,19.94 29.72,23.62 28.45,24.89 28.45,25.91 C3.1 | 33.02,16.64 33.02,13.34 31.88,12.19 31.88,10.29 | 33.02,16.64 38.23,16.64 40.13,14.73 45.59,14.73 46.99,13.34 | 46.99,13.34 48.51,11.81 51.56,11.81 R13.2 | 46.99,13.34 v48.77,15.11
  Top 0.813: 31.88,10.29 v34.29,7.87
  Top 1.016: R16.1 v22.1,8 22.1,9.45 | UEXT.1 55.63,25.4 54.74,24.51 | R11.2 v51.56,17.65 R12.2
  Bottom 0.508: v29.97,26.67 29.59,26.67 28.07,28.19 28.07,30.23 30.35,32.51 30.61,32.51 32.26,34.16 32.26,36.7 30.61,38.35 v28.96,38.35 | 23.5,42.42 18.54,42.42 17.4,41.27 14.99,41.27 v13.34,39.62 | v48.77,15.11 51.31,17.65 v51.56,17.65 | v4.32,20.83 2.79,22.35 2.79,32.26 3.56,33.02 7.87,33.02 8.64,33.78 15.11,33.78 16,32.89 22.23,32.89 22.61,33.27 22.61,35.43 v23.62,36.45 24.51,37.34 24.51,40.89 23.5,41.91 23.5,42.42 | 25.65,8.13 24.77,9.02 23.11,9.02 v22.1,8 | v12.06,46.61 12.19,46.48 15.37,46.48 17.78,44.07 20.83,44.07 21.46,44.7 23.11,44.7 23.5,44.32 23.5,42.42
  Bottom 0.813: v34.29,7.87 34.04,8.13 25.65,8.13
  Bottom 1.016: U$1.3V3 CON1.2 35.56,6.6 v34.29,7.87 | U$1.VCC 59.44,40.01 56.52,37.08 56.52,26.04 UEXT.1
VDD  (via drill 0.6)
  Top 0.254: R1.1 38.61,21.08 39.29,21.76 U1.19
  Top 0.406: v18.29,45.09 18.29,45.97 R3.2
  Top 0.508: 35.43,19.94 C6.1 | 32.89,39.5 C27.1 | C28.1 35.69,39.5 37.21,41.02 37.21,42.04 v36.58,42.67 30.99,42.67 29.72,43.94 v27.94,43.94 26.16,43.94 25.68,43.46 VR2(3.3V).3 | 35.43,19.94 32.26,19.94 31.5,20.7 31.5,22.48 v31.62,22.61 31.62,24.13 33.15,25.65 v33.15,26.04 | 35.43,19.94 36.32,19.94 37.21,20.83 R1.1
  Top 0.61: CON3.20 7.11,20.7 v7.11,19.56
  Top 0.762: L2.2 22.96,39.5 C15.1 24.51,39.5 25.68,40.66 VR2(3.3V).3
  Top 1.016: C28.1 32.89,39.5
  Bottom 0.406: v27.94,43.94 25.02,43.94 23.5,45.47 18.67,45.47 v18.29,45.09
  Bottom 0.508: v33.15,26.04 33.15,26.92 37.34,31.11 37.34,41.91 v36.58,42.67 | 20.45,25.4 20.32,25.53 14.48,25.53 12.83,23.88 11.3,23.88 10.29,24.89 8,24.89 7.11,24 v7.11,19.56
  Bottom 0.61: v31.62,22.61 31.5,22.73 28.96,22.73 27.3,24.38 21.46,24.38 20.45,25.4

### Text on the board
tNames: + | WWW.OLIMEX.COM/DEV | PIC32-PINGUINO | Rev.B | 9-30VDC | + | + | 9-30VDC
bNames: DIGITAL | CON5 | DIGITAL | CON4 | LED2 | LED1 | BUT | AREF | GND | D13 | D12 | D11 | D10 | D9 | D8 | D7 | D6 | D5 | D4 | D3 | D2 | D1 | D0 | USB | DESCRIPTION | STATE | JUMPER | ICSP | UEXT_#CS is connected to G9 | G9/F0 | UEXT_#CS is connected to F0 | G9/F0 | CON3 | LED1 is enabled | LED1_E | LED1 is disabled | LED1_E | PWR_J | PIC32-PINGUINO | 9-30VDC | Rev.B | WWW.OLIMEX.COM/DEV | MADE IN BULGARIA, 2011 | A5 | PWR_LED | A6 | A7 | RST | 3V3 | 5V | GND | GND | VIN | A0 | A1 | A2 | A3 | A4 | + | RST | 3.7V | - | LI_BAT | POWER | CON1 | ANALOG | CON2
213bmp: POLIGONI NA CIFROVOTO ZAHRANVANE I CHARGERA